# EAGLE design aprs_v2 (EAGLE 9.6.2)
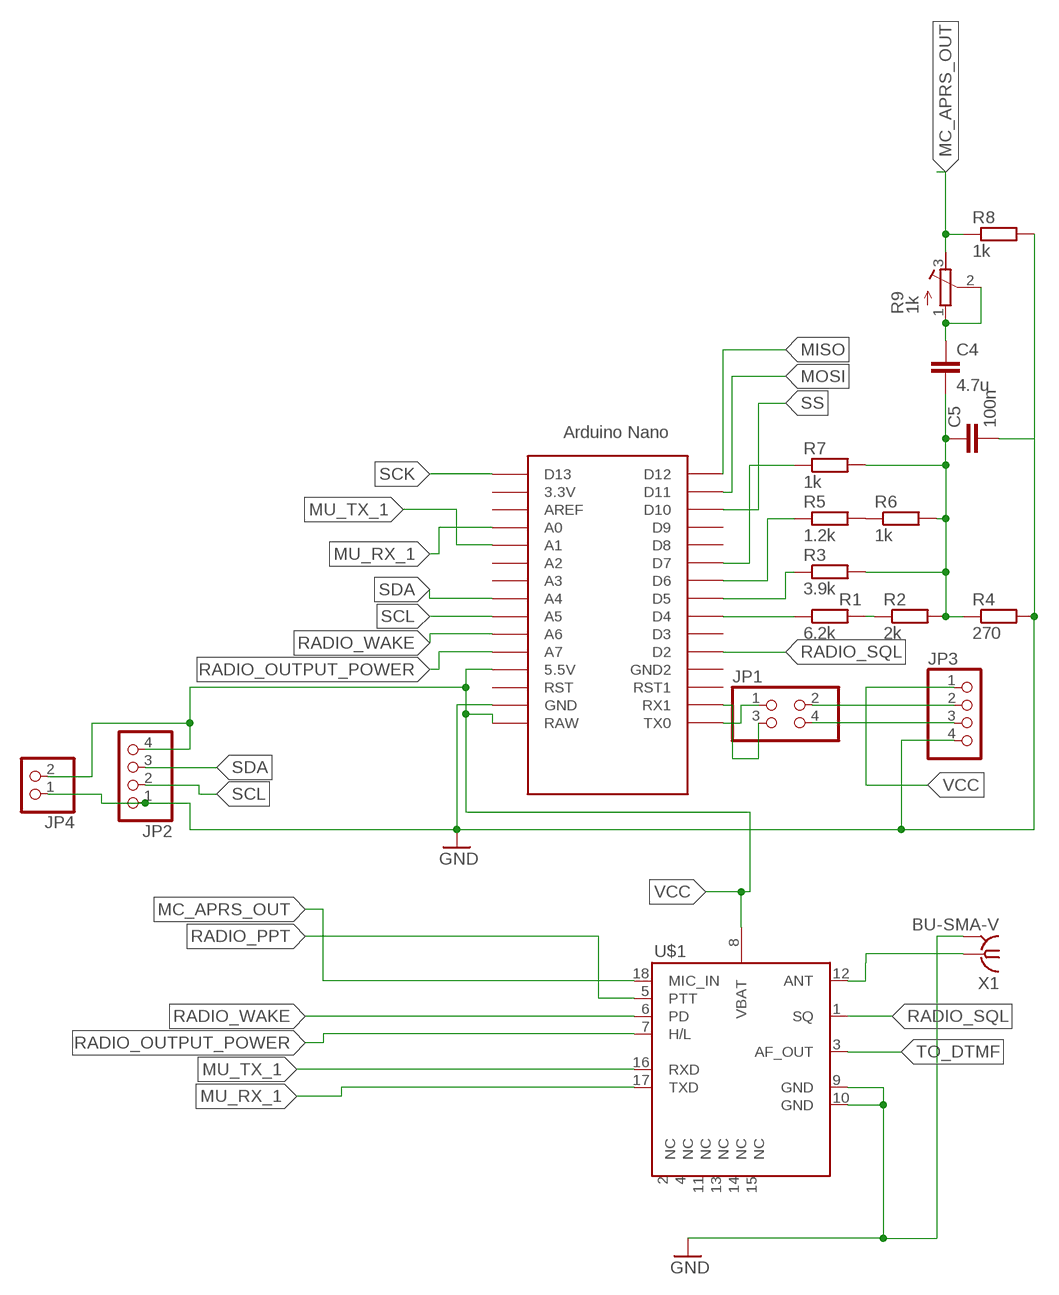
[diagram p0: schematic, sheet 1]

## Parts
C4  4.7u  C-EUC1206  [C1206]
C5  100n  C-EUC0805  [C0805]
JP1  PINHD-2X2  [2X02]
JP2  PINHD-1X4  [1X04]
JP3  PINHD-1X4  [1X04]
JP4  PINHD-1X2  [1X02]
R1  6.2k  R-EU_0207/7  [0207/7]
R2  2k  R-EU_0207/7  [0207/7]
R3  3.9k  R-EU_0207/7  [0207/7]
R4  270  R-EU_0204/7  [0204/7]
R5  1.2k  R-EU_0207/7  [0207/7]
R6  1k  R-EU_0207/7  [0207/7]
R7  1k  R-EU_0204/5  [0204/5]
R8  1k  R-EU_0207/12  [0207/12]
R9  1k  R-TRIMM3339P  [RTRIM3339P]
U$1  DRA818A  [DRA818A]
U$2  NANO  [NANO]
X1  BU-SMA-V  [BU-SMA-V]

## Nets
GND [V_bat]: C5.2 JP2.1 JP3.4 JP4.1 R4.2 R8.2 U$1.9(GND) U$1.10(GND) U$2.GND X1.2 X1.3 X1.4 X1.5
MC_APRS_OUT: R8.1 R9.3(E) U$1.18(MIC_IN)
MISO: U$2.D12
MOSI: U$2.D11
MU_RX_1: U$1.17(TXD) U$2.A0
MU_TX_1: U$1.16(RXD) U$2.A1
N$1: U$1.12(ANT) X1.1
N$2: JP1.1 U$2.TX0
N$3: JP1.2 JP3.2
N$4: R1.1 U$2.D4
N$5: R3.1 U$2.D5
N$6: R5.1 U$2.D6
N$7: R7.1 U$2.D7
N$8: R1.2 R2.1
N$9: R5.2 R6.1
N$10: C4.2 C5.1 R2.2 R3.2 R4.1 R6.2 R7.2
N$11: C4.1 R9.1(A) R9.2(S)
N$12: JP1.3 U$2.RX1
N$13: JP1.4 JP3.3
RADIO_OUTPUT_POWER: U$1.7(H/L) U$2.A7
RADIO_PPT: U$1.5(PTT)
RADIO_SQL: U$1.1(SQ) U$2.D2
RADIO_WAKE: U$1.6(PD) U$2.A6
SCK: U$2.D13
SCL: JP2.2 U$2.A5
SDA: JP2.3 U$2.A4
SS: U$2.D10
TO_DTMF: U$1.3(AF_OUT)
VCC: JP2.4 JP3.1 JP4.2 U$1.8(VBAT) U$2.5V(5.5V) U$2.RAW
Unconnected: U$1.2(NC) U$1.4(NC) U$1.11(NC) U$1.13(NC) U$1.14(NC) U$1.15(NC) U$2.3.3V U$2.A2 U$2.A3 U$2.AREF U$2.D3 U$2.D8 U$2.D9 U$2.GND1(GND2) U$2.ICSP1 U$2.ICSP2 U$2.ICSP3 U$2.ICSP4 U$2.ICSP5 U$2.ICSP6 U$2.RST U$2.RST1

## Library data of the parts
C4 C5 = rcl:C-EU: CAPACITOR, European symbol; SPICEPREFIX: C
JP1 = pinhead:PINHD-2X2: PIN HEADER
JP2 JP3 = pinhead:PINHD-1X4: PIN HEADER
JP4 = pinhead:PINHD-1X2: PIN HEADER
R1-R8 = rcl:R-EU_: RESISTOR, European symbol; SPICEPREFIX: R
R9 = rcl:R-TRIMM: Trimm resistor; SPICEMODEL: X; SPICEPREFIXL: POT
U$1 = dorji:DRA818A
U$2 = Arduino-clone:NANO: Arduino Nano
X1 = con-coax:BU-SMA-V: FEMALE SMA CONNECTOR Radiall distributor RS 112-3794; OC_FARNELL: unknown; OC_NEWARK: unknown

## Net classes
0 default: width 0.356 mm, clearance 0.381 mm
1 PWR: width 0.254 mm, clearance 0.305 mm
2 V_bat: width 0.305 mm, clearance 0.152 mm
3 50 ohm: width 1.21 mm, clearance 0.26 mm

## Board
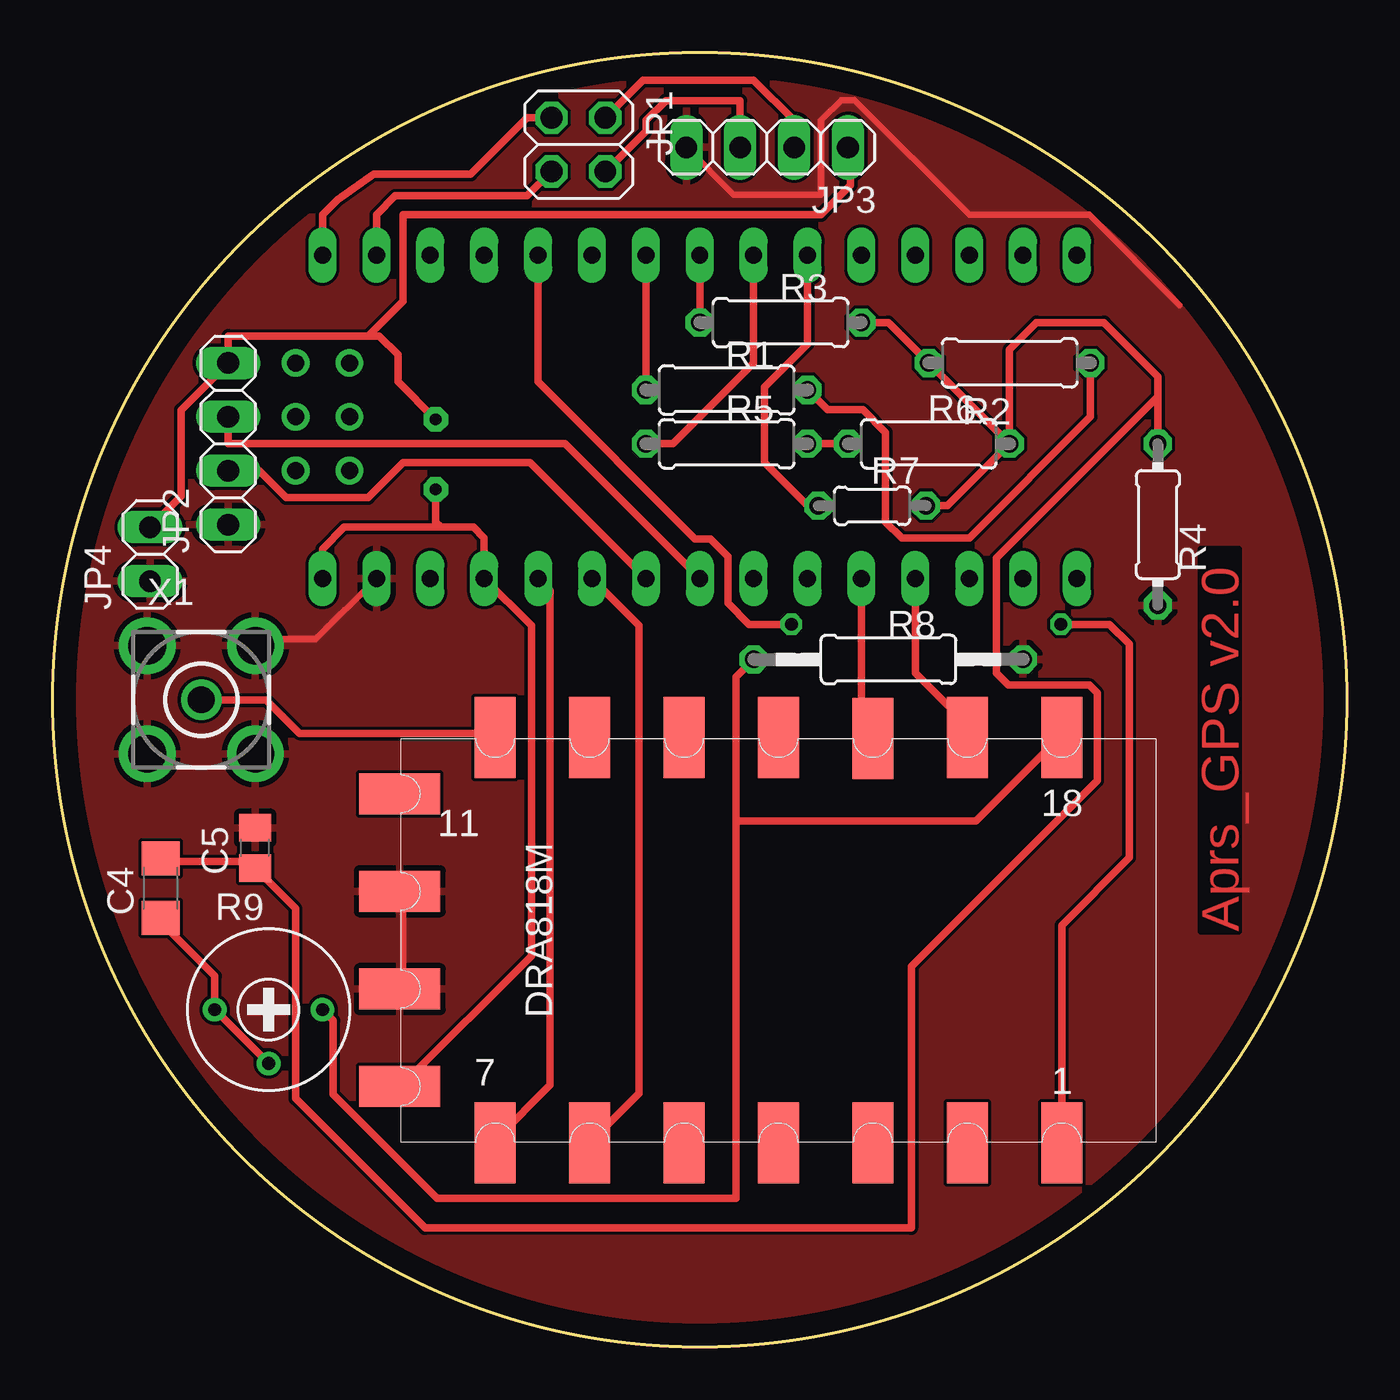
[diagram p1: board, top side]
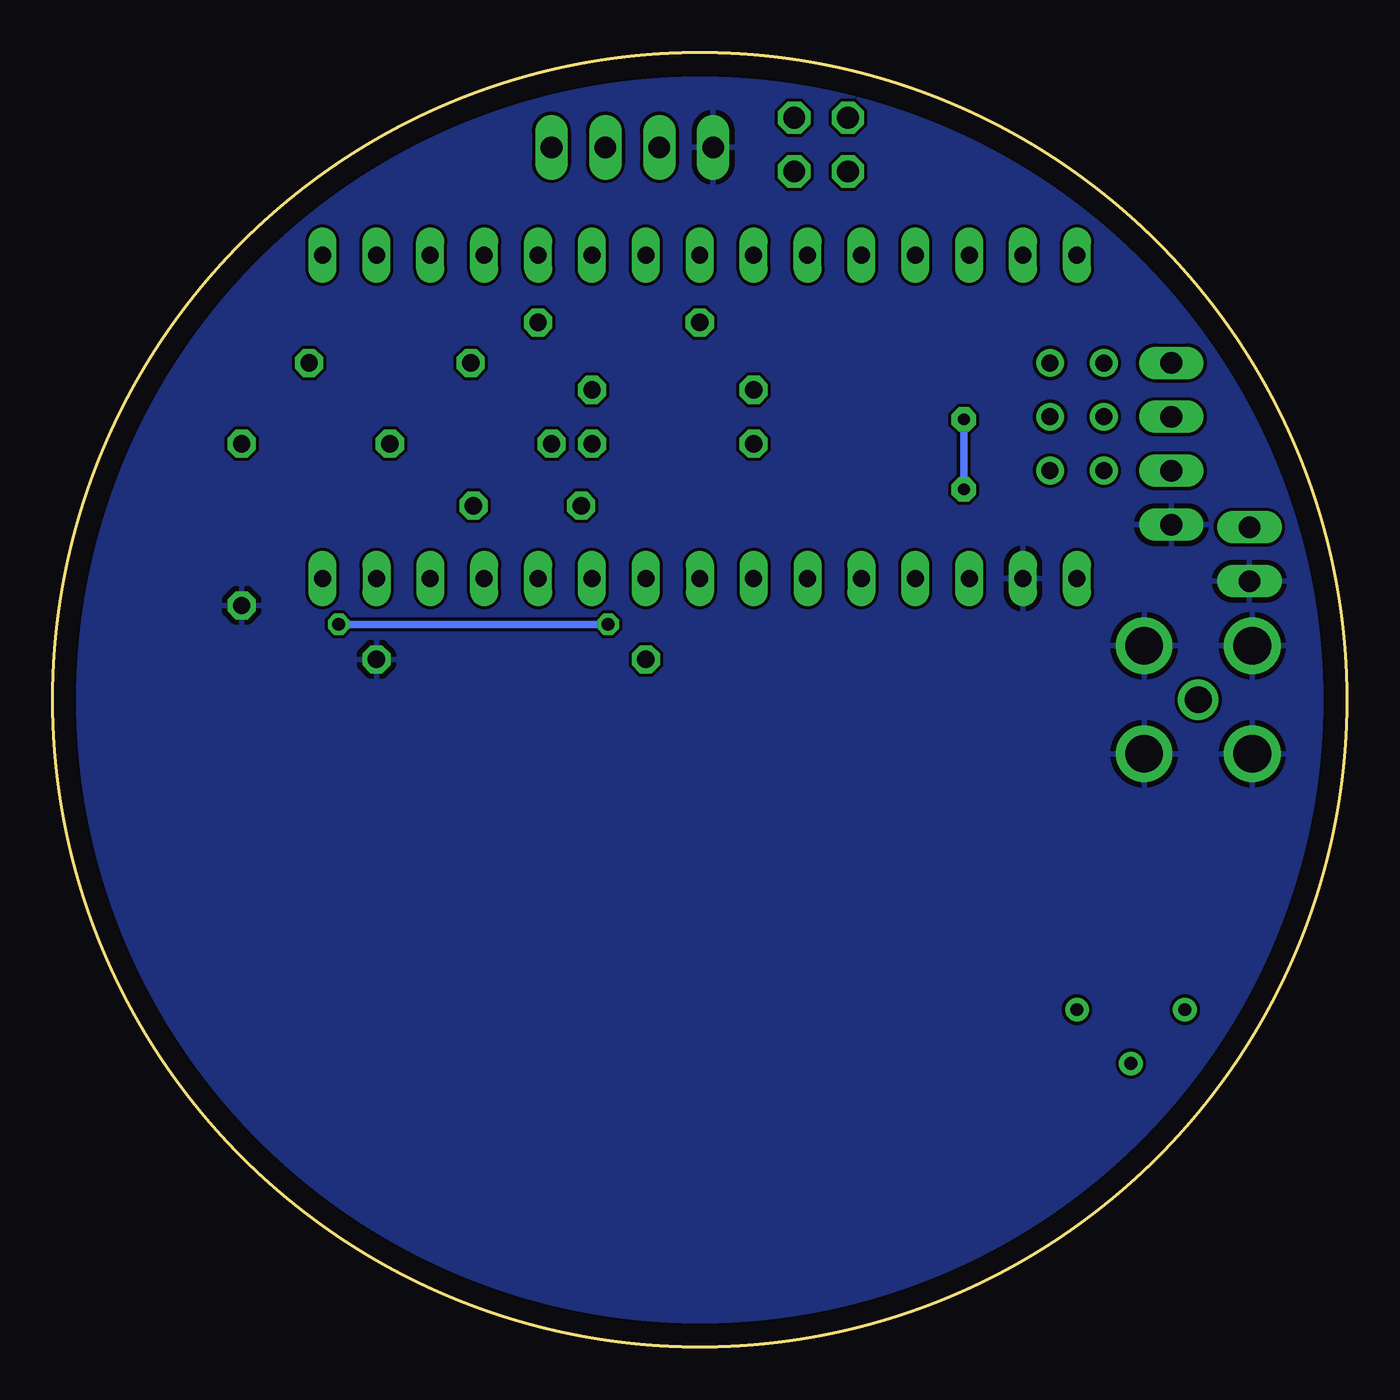
[diagram p2: board, bottom side, seen from below]

Size 60.96 x 60.96 mm. Coordinates in mm from the lower left corner, seen from the top.
Outline: circle at 30.48,30.48 radius 30.48
Copper layers (1*16): Top 0.035mm / dielectric 1.5mm / Bottom 0.035mm
Design rules "default": minimum track width 6mil, minimum drill 0.35mm, track to track 6mil, track to pad 6mil, pad to pad 6mil, via to via 6mil, smd to smd 6mil, copper to edge 40mil, drill to drill 6mil, minimum pad ring 10mil, minimum via ring 8mil, stop-mask expansion 4mil, vias tented up to drill 0mil, thermal gap 10mil

### Footprints (pad centres in the part's own frame; a part is rotated, then mirrored left to right if it is on the bottom)
C1206 = smd 1.6 x 1.8: 1 -1.4,0; 2 1.4,0
C0805 = smd 1.3 x 1.5: 1 -0.95,0; 2 0.95,0
2X02 = drill 1.016 octagon: 1 -1.27,-1.27; 2 -1.27,1.27; 3 1.27,-1.27; 4 1.27,1.27
1X04 = drill 1.016 long: 1 -3.81,0; 2 -1.27,0; 3 1.27,0; 4 3.81,0
1X02 = drill 1.016 long: 1 -1.27,0; 2 1.27,0
0207/7 = drill 0.813 octagon: 1 -3.81,0; 2 3.81,0
0204/7 = drill 0.813 octagon: 1 -3.81,0; 2 3.81,0
0204/5 = drill 0.813 octagon: 1 -2.54,0; 2 2.54,0
0207/12 = drill 0.813 octagon: 1 -6.35,0; 2 6.35,0
RTRIM3339P = drill 0.61: 1 -2.54,0; 2 0,-2.54; 3 2.54,0
DRA818A = smd 3.81 x 1.93: 1 -9.45,-13.25; 2 -9.45,-8.8; 3 -9.45,-4.35; 4 -9.45,0.1; 5 -9.45,4.55; 6 -9.45,9; 7 -9.45,13.45; 12 9.65,13.45; 13 9.65,9; 14 9.65,4.55; 15 9.65,0.1; 16 9.6,-4.35; 17 9.65,-8.8; 18 9.65,-13.25 | smd 1.93 x 3.81: 8 -6.8,17.95; 9 -2.2,17.95; 10 2.4,17.95; 11 7,17.95
NANO = drill 0.8 long: 3.3V -10.16,24.13; 5V -10.16,-1.27; A0 -10.16,19.05; A1 -10.16,16.51; A2 -10.16,13.97; A3 -10.16,11.43; A4 -10.16,8.89; A5 -10.16,6.35; A6 -10.16,3.81; A7 -10.16,1.27; AREF -10.16,21.59; D2 5.08,1.27; D3 5.08,3.81; D4 5.08,6.35; D5 5.08,8.89; D6 5.08,11.43; D7 5.08,13.97; D8 5.08,16.51; D9 5.08,19.05; D10 5.08,21.59; D11 5.08,24.13; D12 5.08,26.67; D13 -10.16,26.67; GND -10.16,-6.35; GND1 5.08,-1.27; RAW -10.16,-8.89; RST -10.16,-3.81; RST1 5.08,-3.81; RX1 5.08,-6.35; TX0 5.08,-8.89 | drill 0.8: ICSP1 -5.08,-10.16; ICSP2 -5.08,-7.62; ICSP3 -2.54,-10.16; ICSP4 -2.54,-7.62; ICSP5 0,-10.16; ICSP6 0,-7.62
BU-SMA-V = drill 1.27: 1 0,0 | drill 1.778: 2 -2.55,2.55; 3 2.55,2.55; 4 2.55,-2.55; 5 -2.55,-2.55

### Placement (x,y rotation side)
C4  5.08,21.59 90 top
C5  9.52,23.5 90 top
JP1  24.76,56.64 270 top
JP2  8.25,42.55 90 top
JP3  33.66,56.52 180 top
JP4  4.57,37.34 90 top
R1  31.75,45.09 0 top
R2  45.08,46.36 180 top
R3  34.29,48.26 0 top
R4  52.07,38.73 270 top
R5  31.75,42.55 0 top
R6  41.27,42.55 0 top
R7  38.61,39.62 0 top
R8  39.37,32.39 0 top
R9  10.16,15.88 0 top
U$1  34.29,19.05 90 top
U$2  21.59,46.36 90 bottom
X1  6.98,30.48 0 top

### Tracks (layer width: path | path; a pad name or v marks a point on that pad's centre or on a via)
GND
  Top 0.305: U$2.GND 12.38,33.34 9.84,33.34 X1.3 | 9.52,33.34 X1.3 | U$1.9 16.51,17.15 16.51,21.27 U$1.10 16.19,21.59 | X1.5 | X1.3 | X1.2 | JP3.4 32.07,54.29 36.19,54.29 36.19,57.79 37.15,58.74 37.78,58.74 43.18,53.34 48.83,53.34 53.09,49.09 | R4.2 52.07,35.69
  pour Top: -2.54,65.41 63.5,65.41 63.5,-14.6 -2.54,-14.6
  pour Bottom: -2.29,61.47 62.23,61.47 62.23,-0.76 -2.29,-0.76
MC_APRS_OUT
  Top 0.356: R9.3 13.21,15.37 13.21,11.87 18.1,6.99 32.19,6.99 32.19,24.77 | 32.19,24.77 32.19,31.56 R8.1 | 32.19,24.77 43.5,24.77 47.31,28.57 U$1.18
MU_RX_1
  Top 0.356: U$1.17 43.09,29.3 40.64,31.75 U$2.A0
MU_TX_1
  Top 0.356: U$2.A1 38.1,28.89 | 38.1,28.89 38.1,28.57 | 38.1,28.89 38.42,28.89 U$1.16
N$1
  Top 0.356: X1.1 10.03,30.48 11.62,28.89 20.64,28.89 U$1.12
N$2
  Top 0.356: U$2.TX0 12.7,53.34 13.41,54.05 15.12,55.25 19.68,55.25 22.35,57.91 JP1.1
N$3
  Top 0.356: JP1.2 27.81,59.69 33.02,59.69 34.92,57.79 JP3.2
N$4
  Top 0.356: U$2.D4 R1.1
N$5
  Top 0.356: U$2.D5 R3.1
N$6
  Top 0.356: U$2.D6 33.02,46.36 29.21,42.55 R5.1
N$7
  Top 0.356: U$2.D7 35.56,47.24 33.53,45.21 33.53,41.66 35.56,39.62 R7.1
N$8
  Top 0.356: R1.2 36.5,44.14 38.17,44.14 39.24,43.07 39.24,38.86 40,38.1 43.18,38.1 48.89,43.81 R2.1
N$9
  Top 0.356: R5.2 R6.1
N$10
  Top 0.356: R3.2 39.37,48.26 R2.2 R6.2 | R7.2 42.16,39.62 R6.2 | R6.2 45.08,46.99 46.36,48.26 49.53,48.26 52.07,45.72 52.07,44.77 | 52.07,44.77 R4.1 | C4.2 5.08,22.86 9.52,22.86 C5.1 11.43,20.64 11.43,11.68 17.53,5.59 40.45,5.59 40.45,17.91 49.21,26.67 49.21,30.8 48.84,31.17 45.03,31.17 44.45,31.75 44.45,37.15 52.07,44.77
N$11
  Top 0.356: C4.1 5.08,20 7.62,17.46 R9.1 R9.2
N$12
  Top 0.356: U$2.RX1 15.24,53.34 16.13,54.23 22.35,54.23 JP1.3
N$13
  Top 0.356: JP1.4 27.94,57.28 27.94,57.79 28.88,58.73 32.39,58.73 JP3.3
RADIO_OUTPUT_POWER
  Top 0.356: U$2.A7 23.43,35.62 23.43,12.32 20.95,9.84 U$1.7
RADIO_SQL  (via drill 0.6 pad 0.85)
  Top 0.356: U$2.D2 22.86,45.47 30.26,38.06 30.98,38.06 31.81,37.24 31.81,35.04 32.81,34.04 v34.8,34.04 | v47.5,34.04 49.78,34.04 50.72,33.1 50.72,23.04 47.54,19.85 U$1.1
  Bottom 0.356: v34.8,34.04 v47.5,34.04
RADIO_WAKE
  Top 0.356: U$2.A6 27.62,33.97 27.62,11.93 U$1.6
SCL
  Top 0.356: U$2.A5 22.48,41.66 16.51,41.66 14.86,40 10.99,40 9.72,41.28 JP2.2
SDA
  Top 0.356: U$2.A4 24.13,42.55 8.25,42.55 JP2.3
VCC  (via drill 0.55 pad 1.15)
  Top 0.356: U$1.8 16.51,12.38 22.54,18.42 22.54,33.97 U$2.5V 20.32,38.1 19.81,38.61 18.29,38.61 | JP3.1 37.59,56.39 37.59,54.74 36.19,53.34 16.51,53.34 16.51,49.28 14.86,47.62 | 14.86,47.62 8.25,47.62 JP2.4 6.03,44.13 6.03,40.07 JP4.2 | U$2.RAW 12.7,37.59 13.72,38.61 18.29,38.61 | 18.29,38.61 18.03,38.86 v18.03,40.39 18.03,40.64 | v18.03,43.69 16.26,45.47 16.26,46.74 15.37,47.62 14.86,47.62
  Bottom 0.356: v18.03,40.39 v18.03,43.69

### Text on the board
Top: Aprs_GPS v2.0